# EAGLE design EFAPS_ (EAGLE 9.2.0)
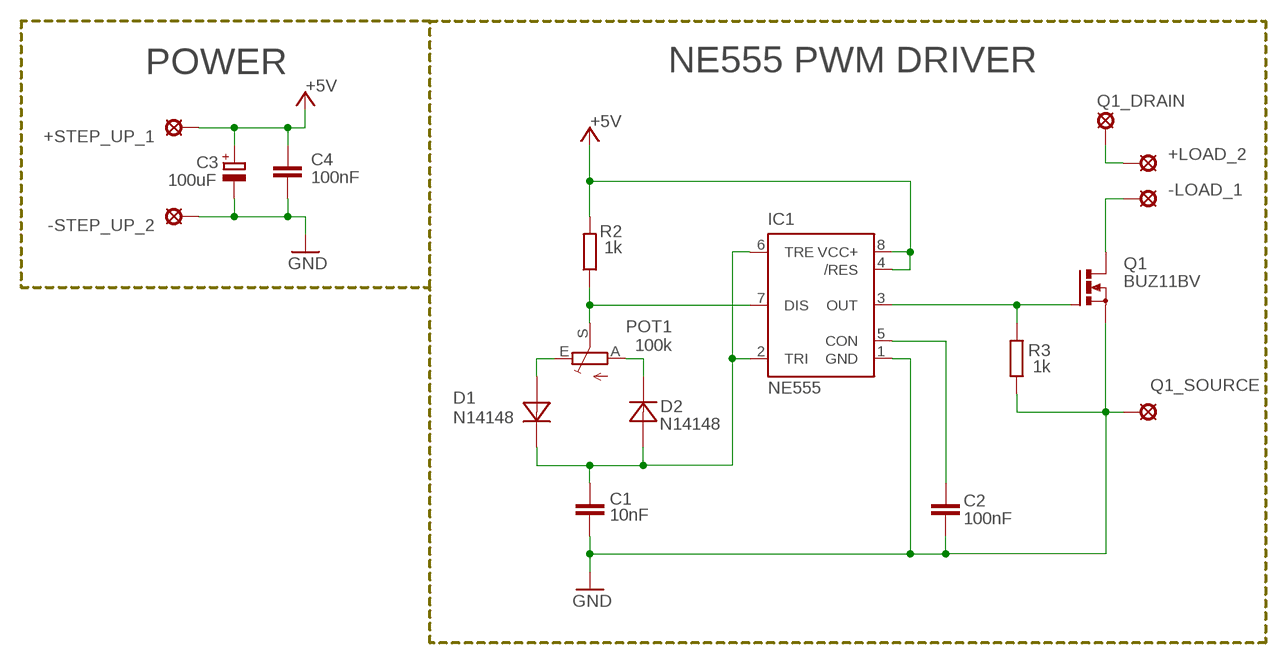
[diagram p0: schematic, sheet 1]

## Parts
+LOAD_2  SE14  [SE14]
+STEP_UP_1  SE14  [SE14]
-LOAD_1  SE14  [SE14]
-STEP_UP_2  SE14  [SE14]
C1  10nF  C-EU050-045-075  [C50-45-75]
C2  100nF  C-EU050-045-075  [C50-45-75]
C3  100uF  C-EU-POL'''  [C5-8,5]
C4  100nF  C-EU050-045-075  [C50-45-75]
D1  N14148  [DO35-7]
D2  N14148  [DO35-7]
IC1  NE555  [DIL-08]
POT1  100k  TRIM_EU-CA6V  [CA6V]
Q1  BUZ11BV  [TO220BV]
Q1_DRAIN  SE14  [SE14]
Q1_SOURCE  SE14  [SE14]
R2  1k  R-EU7  [204/7]
R3  1k  R-EU7  [204/7]

## Nets
+5V: +STEP_UP_1.MP C3.+ C4.P$1 IC1.4(/RES) IC1.8(VCC+) R2.P$2
GND: -STEP_UP_2.MP C1.P$2 C2.P$2 C3.- C4.P$2 IC1.1(GND) Q1.S Q1_SOURCE.MP R3.P$1
N$1: D1.+ POT1.E
N$2: D2.- POT1.A
N$3: IC1.7(DIS) POT1.S R2.P$1
N$4: IC1.3(OUT) Q1.G R3.P$2
N$5: -LOAD_1.MP Q1.D
N$6: C1.P$1 D1.- D2.+ IC1.2(TRI) IC1.6(TRE)
N$7: C2.P$1 IC1.5(CON)
N$8: +LOAD_2.MP Q1_DRAIN.MP

## Notes on the sheet
- POWER | NE555 PWM DRIVER

## Library data of the parts
+LOAD_2 +STEP_UP_1 -LOAD_1 -STEP_UP_2 Q1_DRAIN Q1_SOURCE = solpad:SE14: SOLDER PAD E1553, drill 1,4mm, distributor Buerklin, 07F820
C1 C2 C4 = RCL!:C-EU
C3 = RCL!:C-EU-POL
D1 D2 = Diody, mostki:N14148
IC1 = st-microelectronics:NE555: General purpose bipolar Timer; MF: Arrow Electronics; MPN: NE555N; OC_FARNELL: 1467742; OC_NEWARK: 89K1486
POT1 = pot:TRIM_EU-: POTENTIOMETER
Q1 = transistor-power:BUZ11: N-CHANNEL MOS FET
R2 R3 = RCL!:R-EU

## Board
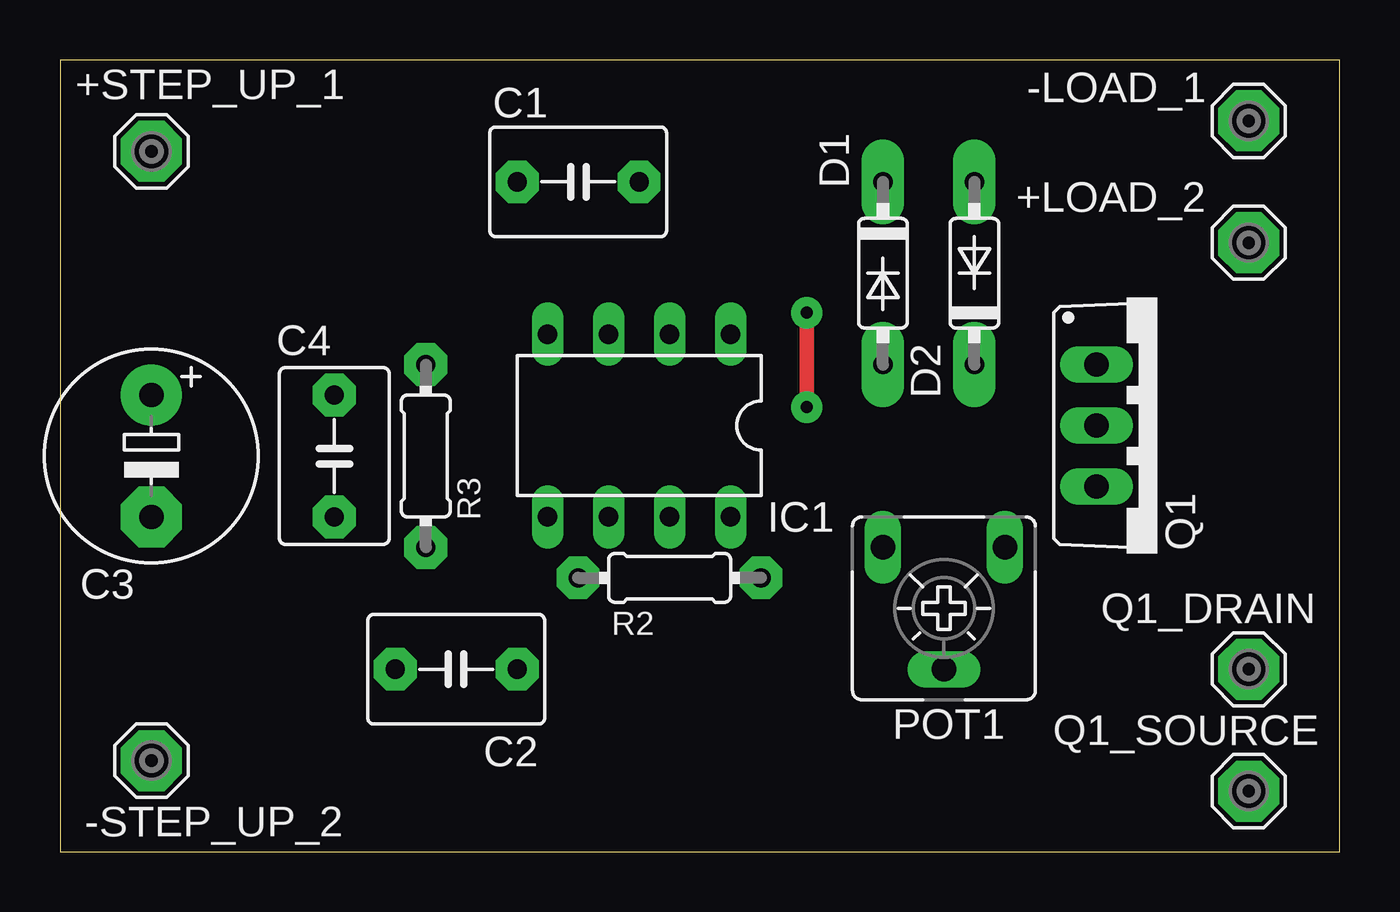
[diagram p1: board, top side]
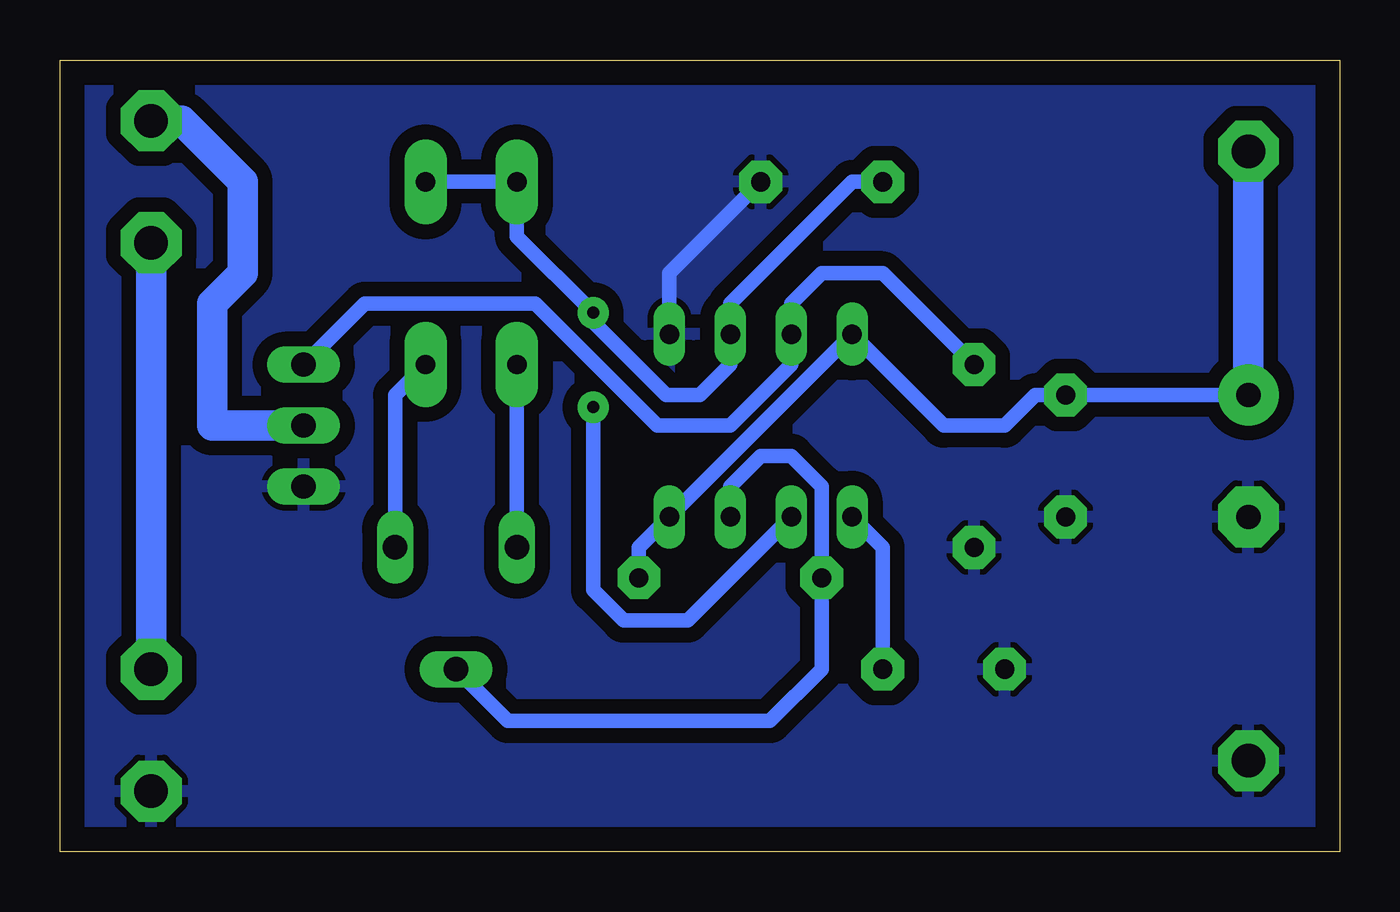
[diagram p2: board, bottom side, seen from below]

Size 53.33 x 33.02 mm. Coordinates in mm from the lower left corner, seen from the top.
Outline: 0,0 53.32,0 53.33,33.02 0.01,33.02 0,0
Copper layers (1*16): Top 0.035mm / dielectric 1.5mm / Bottom 0.035mm
Design rules "default": minimum track width 6mil, minimum drill 0.35mm, track to track 6mil, track to pad 6mil, pad to pad 6mil, via to via 6mil, smd to smd 6mil, copper to edge 40mil, drill to drill 6mil, minimum pad ring 10mil, minimum via ring 8mil, stop-mask expansion 4mil, vias tented up to drill 0mil, thermal gap 10mil

### Footprints (pad centres in the part's own frame; a part is rotated, then mirrored left to right if it is on the bottom)
SE14 = drill 1.397 pad 2.54 octagon: MP 0,0
C50-45-75 = drill 0.8 pad 1.778 octagon: P$1 -2.54,0; P$2 2.54,0
C5-8,5 = drill 1.016 pad 2.54: + -2.54,0 | drill 1.016 pad 2.54 octagon: - 2.54,0
DO35-7 = drill 0.8 pad 1.778 long: + 3.81,0; - -3.81,0
DIL-08 = drill 0.813 long: 1 -3.81,-3.81; 2 -1.27,-3.81; 3 1.27,-3.81; 4 3.81,-3.81; 5 3.81,3.81; 6 1.27,3.81; 7 -1.27,3.81; 8 -3.81,3.81
CA6V = drill 1.016 long: A -2.54,-2.54; E 2.54,-2.54; S 0,2.54
TO220BV = drill 1.016 long: D 0,-2.54; G -2.54,-2.54; S 2.54,-2.54
204/7 = drill 0.8 pad 1.778 octagon: P$1 -3.81,0; P$2 3.81,0

### Placement (x,y rotation side)
+LOAD_2  49.53,25.4 0 top
+STEP_UP_1  3.81,29.21 0 top
-LOAD_1  49.53,30.48 0 top
-STEP_UP_2  3.81,3.81 0 top
C1  21.59,27.94 0 top
C2  16.51,7.62 180 top
C3  3.81,16.51 270 top
C4  11.43,16.51 270 top
D1  34.29,24.13 270 top
D2  38.1,24.13 90 top
IC1  24.13,17.78 180 top
POT1  36.83,10.16 180 top
Q1  45.72,17.78 270 top
Q1_DRAIN  49.53,7.62 0 top
Q1_SOURCE  49.53,2.54 0 top
R2  25.4,11.43 0 top
R3  15.24,16.51 90 top

### Tracks (layer width: path | path; a pad name or v marks a point on that pad's centre or on a via)
+5V
  Bottom 0.61: C3.+ C4.P$1 12.7,19.05 13.97,17.78 16.51,17.78 IC1.4 IC1.8 29.21,12.7 R2.P$2
  Bottom 1.27: +STEP_UP_1.MP C3.+
GND
  Bottom 0.61: C1.P$2 27.94,24.13 IC1.1
  pour Bottom (isolate 0.61): 0,33.02 53.34,33.02 53.34,0 0,0
N$1
  Bottom 0.61: D1.+ POT1.E
N$2
  Bottom 0.61: D2.- 39.37,19.05 POT1.A
N$3
  Bottom 0.61: POT1.S 34.67,5.46 23.75,5.46 21.59,7.62 R2.P$1 21.59,15.24 22.86,16.51 24.13,16.51 25.4,15.24 IC1.7
N$4
  Bottom 0.61: Q1.G 40.64,22.86 33.53,22.86 28.45,17.78 25.4,17.78 22.86,20.32 IC1.3 22.86,22.86 21.59,24.13 19.05,24.13 R3.P$2
N$5
  Bottom 1.27: Q1.D 46.99,17.78 46.99,22.86 45.72,24.13 45.72,27.94 48.26,30.48 -LOAD_1.MP
N$6  (via drill 0.5 pad 1.3)
  Top 0.61: v31.11,22.48 v31.11,18.54
  Bottom 0.61: C1.P$1 20.32,27.94 25.4,22.86 IC1.2 25.4,20.32 26.67,19.05 28.07,19.05 31.11,22.1 v31.11,22.48 34.29,25.65 D1.- D2.+ | IC1.6 27.18,9.65 29.84,9.65 31.11,10.92 v31.11,18.54
N$7
  Bottom 0.61: C2.P$1 19.05,12.7 IC1.5
N$8
  Bottom 1.27: +LOAD_2.MP Q1_DRAIN.MP

### Text on the board
Document: ZW